# EasyEDA schematic Prática-00.json
TITLE: Sheet_1; REV: 1.0; Date: 2020-08-14; Sheet: 1/1; Company: Your Company
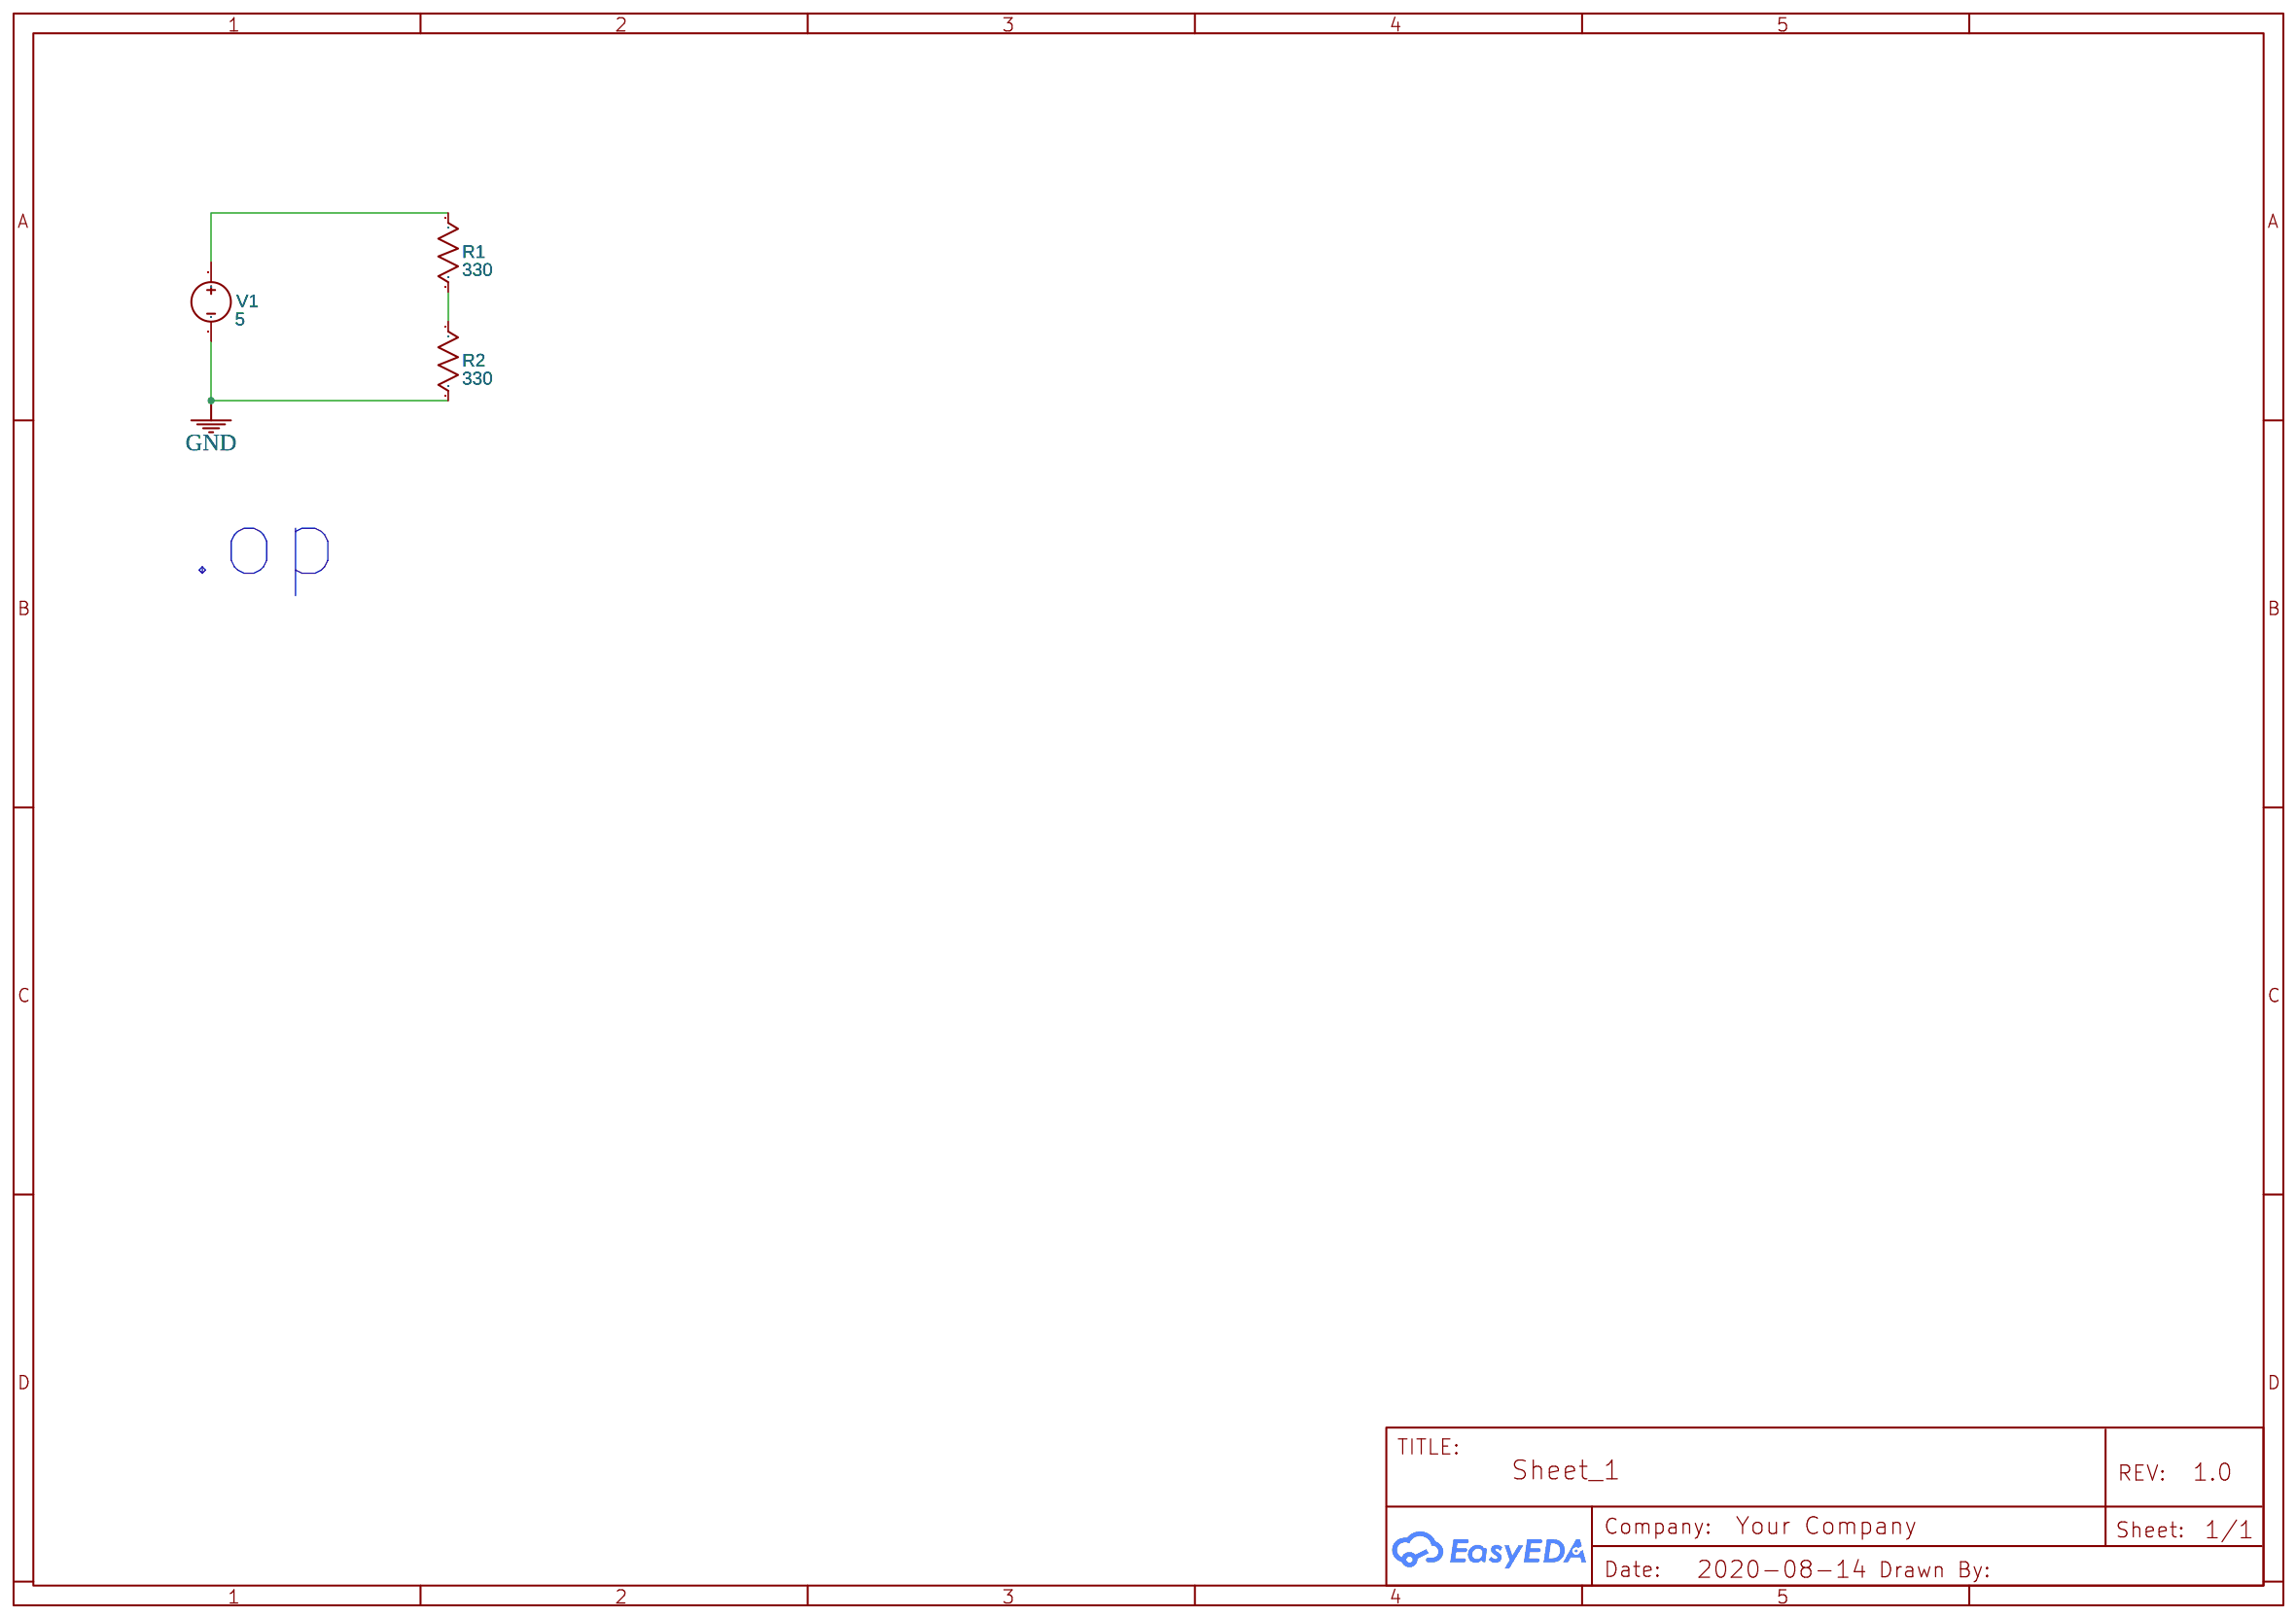
[diagram p0: schematic sheet]

## Parts
R1  330  [AXIAL-0.3]
R2  330  [AXIAL-0.3]
V1  5  [HDR1X2]

## Library data of the parts
R1 R2 = Resistor_US: Resistance: 1k; Contributor: EasyEDA; Supplier: YUJING
V1 = VDC: Contributor: EasyEDA; sim: true

## Nets
GND: R2.2 V1.2
Net-(R1-1): R1.1 V1.1
Net-(R1-2): R1.2 R2.1

## Notes on the sheet
- .op
